# Altium schematic sheet ChargeContactBoard.SchDoc
size A
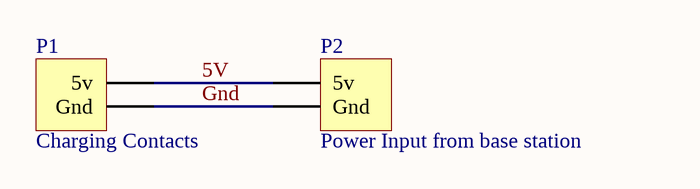
[diagram p0: ChargeContactBoard.SchDoc]

## Parts
P1  Charging Contacts  [Modular 2pin contact]
P2  Power Input from base station  [Charger Board Connector Male]

## Nets
5V: P1.2(5v) P2.3(5v)
Gnd: P1.1(Gnd) P2.2(Gnd)

## Library data of the parts
P1 P2 = Header 2: Header, 2-Pin; LatestRevisionDate: 17-Jul-2002; LatestRevisionNote: Re-released for DXP Platform.; Publisher: Altium Limited; Supplier 1: Digi-Key
  P1: Supplier Part Number 1: 70ADJ-2-ML1GDKR-ND
  P2: Supplier Part Number 1: 3M9353TR-ND; Supplier 2: Mouser; Supplier Part Number 2: 517-951104-4620-ARPR